# Altium schematic sheet preliminaryschematic.SchDoc
size A
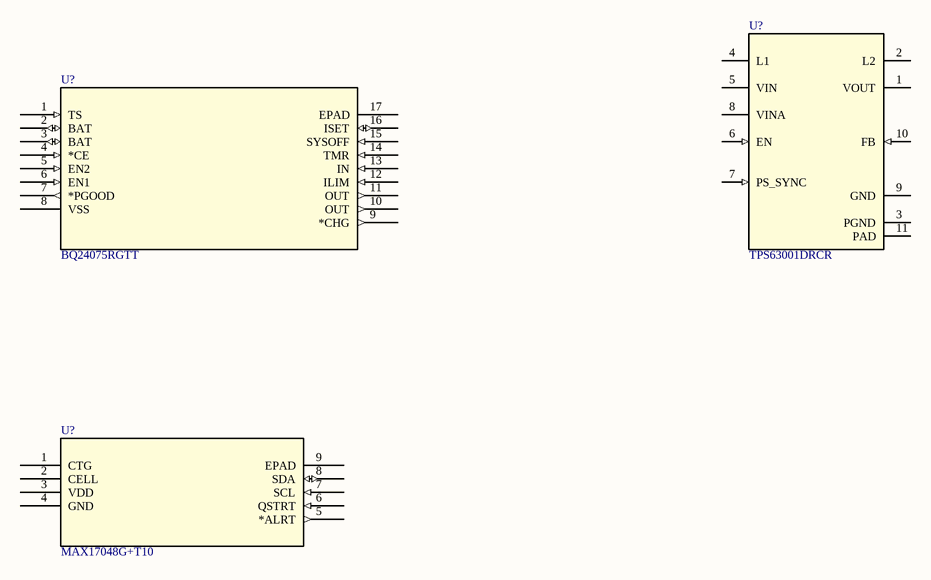
[diagram p0: preliminaryschematic.SchDoc]

## Parts
(Parts that share a designator on the sheet are numbered #1, #2 ... from top to bottom, then left to right.)
U?#1  BQ24075RGTT  [RGT16_1P7X1P7]
U?#2  TPS63001DRCR  [DRC0010J]
U?#3  MAX17048G+T10  [21-0168E_T822-3_MXM]

## Nets

Not connected (* = marked no-connect by the designer): U?#1 1(TS) 2(BAT) 3(BAT) 4(*CE) 5(EN2) 6(EN1) 7(*PGOOD) 8(VSS) 9(*CHG) 10(OUT) 11(OUT) 12(ILIM) 13(IN) 14(TMR) 15(SYSOFF) 16(ISET) 17(EPAD); U?#2 1(VOUT) 2(L2) 3(PGND) 4(L1) 5(VIN) 6(EN) 7(PS_SYNC) 8(VINA) 9(GND) 10(FB) 11(PAD); U?#3 1(CTG) 2(CELL) 3(VDD) 4(GND) 5(*ALRT) 6(QSTRT) 7(SCL) 8(SDA) 9(EPAD)

## Library data of the parts
U?#1 = BQ24075RGTT: No Description Available; Mfr_Name: Texas Instruments; RefDes: RefDes; Type: Type
U?#2 = TPS63001DRCR: No Description Available; Mfr_Name: Texas Instruments; Alternate_PartNumber: TPS63001DRCT; CompType: IC; TYPE: TYPE; RefDes: RefDes; Application_BuildNumber: *; PartNumber: TPS63001DRCR; PackageReference: DRC0010J; MountType: SMT; RoHS: Y; Manufacturer: Texas Instruments
U?#3 = MAX17048G+T10: No Description Available; Mfr_Name: Analog Devices Inc; RefDes: RefDes; Type: Type